# Altium schematic sheet RS232.SchDoc
size 420 x 297 mm; SheetNumber: 24; SheetTotal: 34
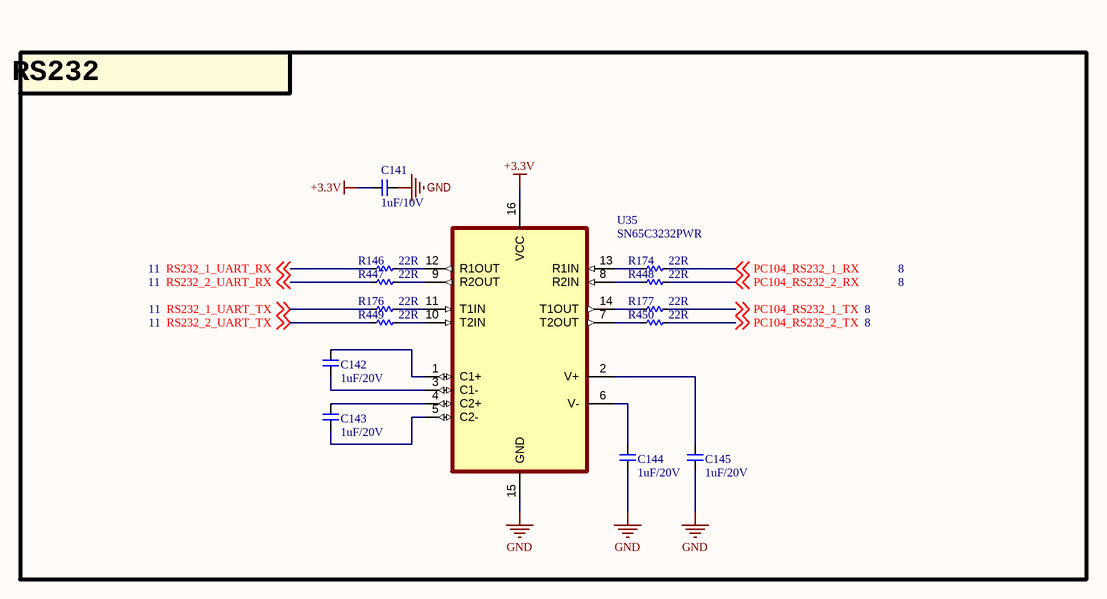
[diagram p0: RS232.SchDoc]

## Parts
C141  1uF/10V  [CAP_C_1005X50_L]
C142  1uF/20V  [CAP_C_1005X50_L]
C143  1uF/20V  [CAP_C_1005X50_L]
C144  1uF/20V  [CAP_C_1005X50_L]
C145  1uF/20V  [CAP_C_1005X50_L]
R146  22R  [RES_C_1005x30_L]
R174  22R  [RES_C_1005x30_L]
R176  22R  [RES_C_1005x30_L]
R177  22R  [RES_C_1005x30_L]
R447  22R  [RES_C_1005x30_L]
R448  22R  [RES_C_1005x30_L]
R449  22R  [RES_C_1005x30_L]
R450  22R  [RES_C_1005x30_L]
U35  SN65C3232PWR  [SOP65P640X120-16N]

## Blocks framed on the sheet
RS232: C141-C145 R146 R174 R176 R177 R447-R450 U35

## Nets
+3.3V: C141.2 U35.16(VCC)
GND: C141.1 C144.1 C145.1 U35.15(GND)
PC104_RS232_1_RX: R174.2 ; off-sheet PC104_RS232_1_RX
PC104_RS232_1_TX: R177.2 ; off-sheet PC104_RS232_1_TX
PC104_RS232_2_RX: R448.2 ; off-sheet PC104_RS232_2_RX
PC104_RS232_2_TX: R450.2 ; off-sheet PC104_RS232_2_TX
RS232_1_UART_RX: R146.1 ; off-sheet RS232_1_UART_RX
RS232_1_UART_TX: R176.1 ; off-sheet RS232_1_UART_TX
RS232_2_UART_RX: R447.1 ; off-sheet RS232_2_UART_RX
RS232_2_UART_TX: R449.1 ; off-sheet RS232_2_UART_TX
NetC142_1: C142.1 U35.1(C1+)
NetC142_2: C142.2 U35.3(C1-)
NetC143_1: C143.1 U35.4(C2+)
NetC143_2: C143.2 U35.5(C2-)
NetC144_2: C144.2 U35.6(V-)
NetC145_2: C145.2 U35.2(V+)
NetR146_2: R146.2 U35.12(R1OUT)
NetR174_1: R174.1 U35.13(R1IN)
NetR176_2: R176.2 U35.11(T1IN)
NetR177_1: R177.1 U35.14(T1OUT)
NetR447_2: R447.2 U35.9(R2OUT)
NetR448_1: R448.1 U35.8(R2IN)
NetR449_2: R449.2 U35.10(T2IN)
NetR450_1: R450.1 U35.7(T2OUT)

## Notes on the sheet
- Project:
- Sub-system:
- Design by:
- Sheet title:
- Sheet
- of
- Checked by:
- Approved by:
- Revision:
- Document No:
- Size:
- Date:
- A3

## Library data of the parts
C141-C145 = _CAP_C_2: CAP CHIP
R146 R174 R176 R177 R447-R450 = _RES_B_2: RES
U35 = IC_RS232_SN65C3232PWR: 2/2 Transceiver Full RS232 16-TSSOP 1GHz; MF: Analog Devices; MP: MAX3232CSE+T; SnapEDA_Link: https://www.snapeda.com/parts/MAX3232CSE+T/Analog+Devices/view-part/?ref=snap; Package: SOIC-16 Maxim Integrated; Value: *; Check_prices: https://www.snapeda.com/parts/MAX3232CSE+T/Analog+Devices/view-part/?ref=eda